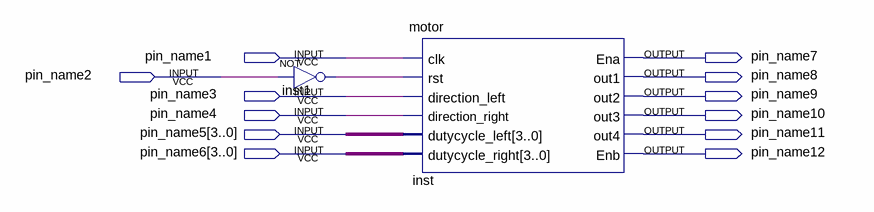
[diagram p0: schematic sheet]
// Quartus schematic motortest.bdf as structural Verilog: 2 symbols, 12 pins
module motortest (
  input  pin_name1,
  input  pin_name2,
  input  pin_name3,
  input  pin_name4,
  input  [3:0] pin_name5,
  input  [3:0] pin_name6,
  output pin_name7,
  output pin_name8,
  output pin_name9,
  output pin_name10,
  output pin_name11,
  output pin_name12
);

  wire inst1_out;

  not inst1 (inst1_out, pin_name2);
  motor inst (
    .clk(pin_name1), .rst(inst1_out), .direction_left(pin_name3), .direction_right(pin_name4),
    .dutycycle_left(pin_name5), .dutycycle_right(pin_name6), .Ena(pin_name7), .out1(pin_name8),
    .out2(pin_name9), .out3(pin_name10), .out4(pin_name11), .Enb(pin_name12));
endmodule
